# Altium schematic sheet [09] - MICROCONTROLLER UNIT.SchDoc
size A2; DocumentNumber: 9; SheetNumber: 9; SheetTotal: 12; PageSetup: Record=PageOptions|CenterHorizontal=True|CenterVertical=True|PrintScale=0.73|XCorrection=1.00|YCorrection=1.00|PrintKind=0|BorderSize=5000000|LeftOffset=0|BottomOffset=0|Orientation=2|PaperLength=1000|PaperWidth=1000|Scale=100|PaperSource=7|PrintQuality=-3|MediaType=1|DitherType=10|PrintScaleMode=1|PaperKind=A3|PaperIndex=8
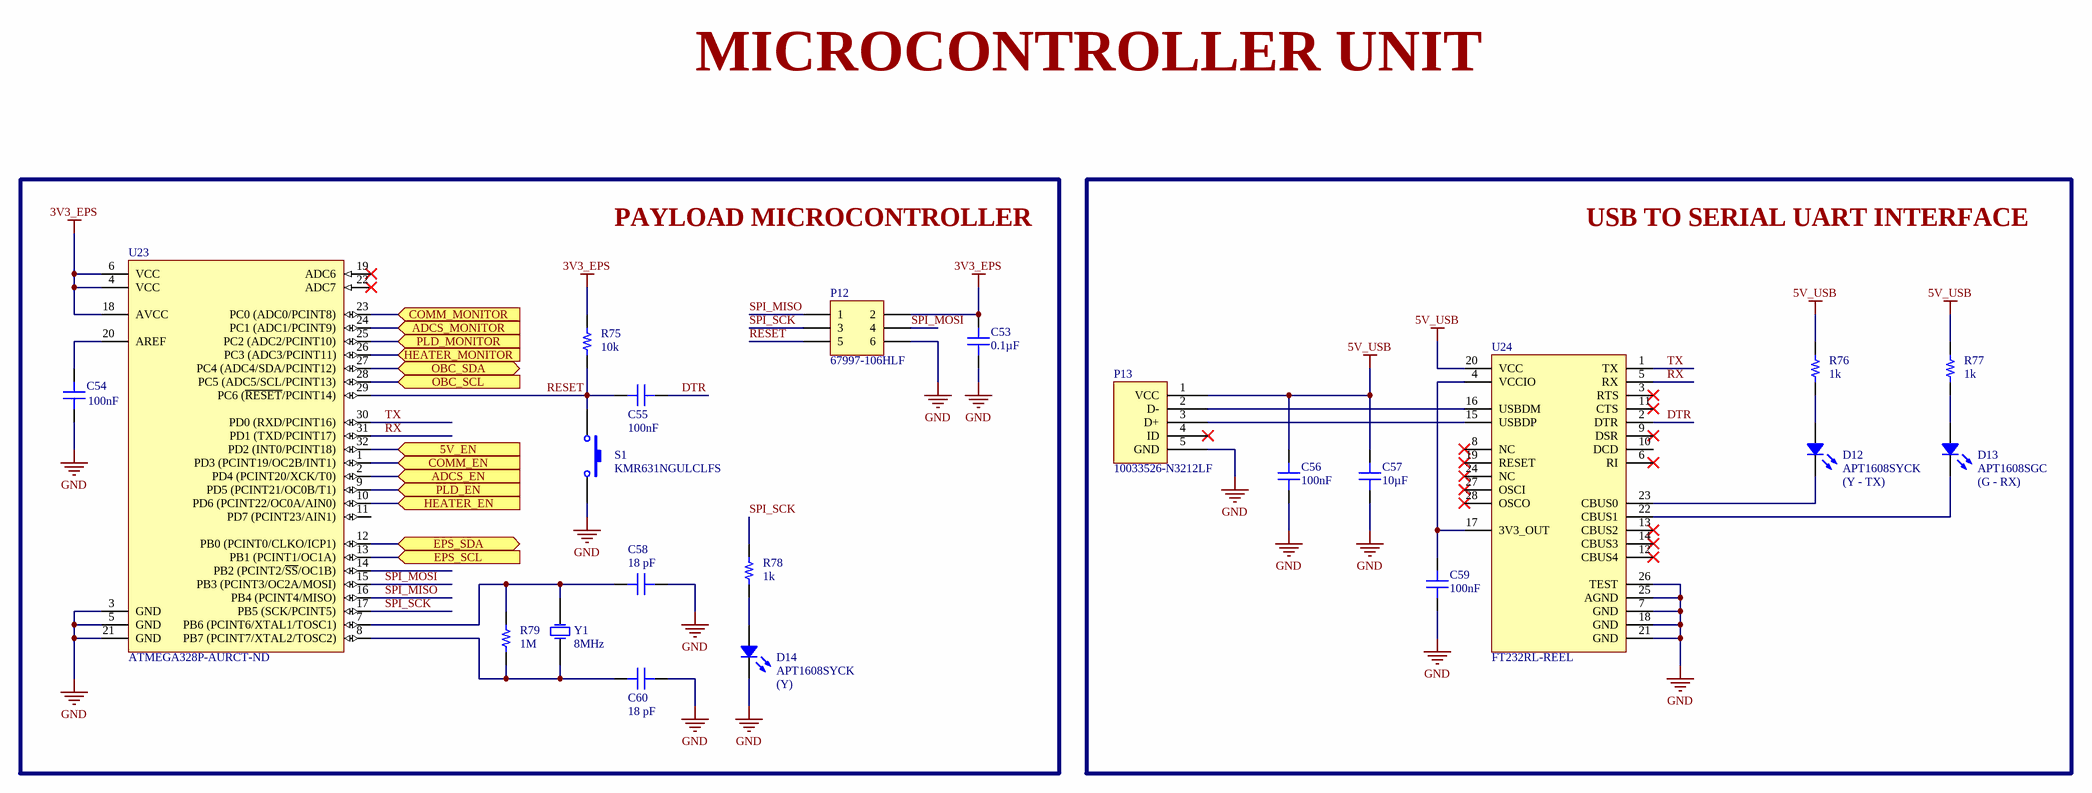
[diagram p0: [09] - MICROCONTROLLER UNIT.SchDoc]

## Parts
C53  Capacitance: 0.1µF  [CAP 0805/2012]  (hidden comment: C2012X7R1H104K085AA)
C54  Capacitance: 100nF  [CAP 0603/1608]  (hidden comment: C0603C104K8RACTU)
C55  Capacitance: 100nF  [CAP 0603/1608]  (hidden comment: C0603C104K8RACTU)
C56  Capacitance: 100nF  [CAP 0603/1608]  (hidden comment: C0603C104K8RACTU)
C57  Capacitance: 10µF  [CAP 0805/2012]  (hidden comment: LMK212BJ106KG-T)
C58  Capacitance: 18 pF  [CAP 0805/2012]  (hidden comment: C0805C180J5GAC-TU)
C59  Capacitance: 100nF  [CAP 0603/1608]  (hidden comment: C0603C104K8RACTU)
C60  Capacitance: 18 pF  [CAP 0805/2012]  (hidden comment: C0805C180J5GAC-TU)
D12  APT1608SYCK  [LED 0603/1608 YELLOW]
D13  APT1608SGC  [LED 0603/1608 GREEN]
D14  APT1608SYCK  [LED 0603/1608 YELLOW]
P12  67997-106HLF  [67997-106HLF]
P13  10033526-N3212LF  [FCI USB 10033526-N3212LF]
R75  Resistance: 10k  [RES 0603/1608]  (hidden comment: RNCP0603FTD10K0)
R76  Resistance: 1k  [RES 0603/1608]  (hidden comment: ESR03EZPJ102)
R77  Resistance: 1k  [RES 0603/1608]  (hidden comment: ESR03EZPJ102)
R78  Resistance: 1k  [RES 0603/1608]  (hidden comment: ESR03EZPJ102)
R79  Resistance: 1M  [RES 0805/2012]  (hidden comment: RT0805FRE071ML)
S1  KMR631NGULCLFS  [KMR631NGLFS]
U23  ATMEGA328P-AURCT-ND  [32A_L]
U24  FT232RL-REEL  [SOP65P790X200-28N]
Y1  Frequency: 8MHz  [ABM7]  (hidden comment: 535-9831-1-ND)

## Blocks framed on the sheet
PAYLOAD MICROCONTROLLER: C53-C55 C58 C60 D14 P12 R75 R78 R79 S1 U23 Y1
USB TO SERIAL UART INTERFACE: C56 C57 C59 D12 D13 P13 R76 R77 U24

## Ports
5V_EN (in), ADCS_EN (in), ADCS_MONITOR (in), COMM_EN (in), COMM_MONITOR (in), EPS_SCL (in), EPS_SDA (bidir), HEATER_EN (in), HEATER_MONITOR (in), OBC_SCL (in), OBC_SDA (bidir), PLD_EN (in), PLD_MONITOR (in)

## Nets
3V3_EPS: C53.2 P12.2 R75.2 U23.4(VCC) U23.6(VCC) U23.18(AVCC)
5V_USB: C56.1 C57.2 P13.1(VCC) R76.2 R77.2 U24.20(VCC)
GND: C53.1 C54.1 C56.2 C57.1 C58.2 C59.2 C60.2 D14.2 P12.6 P13.5(GND) S1.2 U23.3(GND) U23.5(GND) U23.21(GND) U24.7(GND) U24.18(GND) U24.21(GND) U24.25(AGND) U24.26(TEST)
5V_EN: U23.32(PD2_(INT0/PCINT18)) ; port 5V_EN
ADCS_EN: U23.2(PD4_(PCINT20/XCK/T0)) ; port ADCS_EN
ADCS_MONITOR: U23.24(PC1_(ADC1/PCINT9)) ; port ADCS_MONITOR
COMM_EN: U23.1(PD3_(PCINT19/OC2B/INT1)) ; port COMM_EN
COMM_MONITOR: U23.23(PC0_(ADC0/PCINT8)) ; port COMM_MONITOR
DTR: C55.1 U24.2(DTR)
EPS_SCL: U23.13(PB1_(PCINT1/OC1A)) ; port EPS_SCL
EPS_SDA: U23.12(PB0_(PCINT0/CLKO/ICP1)) ; port EPS_SDA
HEATER_EN: U23.10(PD6_(PCINT22/OC0A/AIN0)) ; port HEATER_EN
HEATER_MONITOR: U23.26(PC3_(ADC3/PCINT11)) ; port HEATER_MONITOR
OBC_SCL: U23.28(PC5_(ADC5/SCL/PCINT13)) ; port OBC_SCL
OBC_SDA: U23.27(PC4_(ADC4/SDA/PCINT12)) ; port OBC_SDA
PLD_EN: U23.9(PD5_(PCINT21/OC0B/T1)) ; port PLD_EN
PLD_MONITOR: U23.25(PC2_(ADC2/PCINT10)) ; port PLD_MONITOR
RESET: C55.2 P12.5 R75.1 S1.1 U23.29(PC6_(~{RESET}/PCINT14))
RX: U23.31(PD1_(TXD/PCINT17)) U24.5(RX)
SPI_MISO: P12.1 U23.16(PB4_(PCINT4/MISO))
SPI_MOSI: P12.4 U23.15(PB3_(PCINT3/OC2A/MOSI))
SPI_SCK: P12.3 R78.2 U23.17(PB5_(SCK/PCINT5))
TX: U23.30(PD0_(RXD/PCINT16)) U24.1(TX)
NetC54_2: C54.2 U23.20(AREF)
NetC58_1: C58.1 R79.1 U23.7(PB6_(PCINT6/XTAL1/TOSC1)) Y1.2(OSC2)
NetC59_1: C59.1 U24.4(VCCIO) U24.17(3V3_OUT)
NetC60_1: C60.1 R79.2 U23.8(PB7_(PCINT7/XTAL2/TOSC2)) Y1.1(OSC1)
NetD12_1: D12.1 R76.1
NetD12_2: D12.2 U24.23(CBUS0)
NetD13_1: D13.1 R77.1
NetD13_2: D13.2 U24.22(CBUS1)
NetD14_1: D14.1 R78.1
NetP13_2: P13.2(D-) U24.16(USBDM)
NetP13_3: P13.3(D+) U24.15(USBDP)

Not connected (* = marked no-connect by the designer): P13 4(ID)*; U23 11(PD7_(PCINT23/AIN1)) 14(PB2_(PCINT2/~{SS}/OC1B)) 19(ADC6)* 22(ADC7)*; U24 3(RTS)* 6(RI)* 8(NC)* 9(DSR)* 10(DCD) 11(CTS)* 12(CBUS4)* 13(CBUS2)* 14(CBUS3)* 19(RESET)* 24(NC)* 27(OSCI)* 28(OSCO)*

## Notes on the sheet
- MICROCONTROLLER UNIT
- (near D12) (Y - TX)
- (near D13) (G - RX)
- (near D14) (Y)
- Project:
- Page Contents:
- Size:
- Revision:
- A2
- Document Number:
- Design:
- Date:
- Sheet
- of

## Library data of the parts
C53 = C2012X7R1H104K085AA: CAP CER 0.1UF 50V X7R 0805; Manufacturer: TDK; PCN Part Number: MLCC Part Number Change 30/Nov/2012; Product Training Modules: C Series General Applications SEAT, CCV, and TVCL Design Tools Guide to Replacing an Electrolytic Capacitor with an MLCC; Tolerance: ±10%; Online Catalog: C Series, General Purpose; Kits: 445-9015-KIT-ND  - KIT MLCC 1000PF-47UF 0805 10-50V; Other Names: 445-7534-1; Supplier 1: Digi-Key; Manufacturer Part Number: C2012X7R1H104K085AA; Stock 1: 6397; Pricing 1: 1=0.12, 10=0.086, 100=0.0403, 500=0.0282, 1000=0.0234 (USD); RoHS Information: RoHS Certificate-MLCC; Standard Package: 1; Category: Capacitors; Family: Ceramic Capacitors; Series: C; Packaging: Cut Tape (CT); Voltage - Rated: 50V; Temperature Coefficient: X7R; Mounting Type: Surface Mount, MLCC; Operating Temperature: -55°C ~ 125°C; Applications: General Purpose; Ratings: -; Package / Case: 0805 (2012 Metric); Size / Dimension: 0.079" L x 0.049" W (2.00mm x 1.25mm); Height - Seated (Max): -; Thickness (Max): 0.037" (0.95mm); Lead Spacing: -; Features: -; Lead Style: -; ComponentLink1URL: https://datasheet.ciiva.com/11788/0900766b80c1bb00-11788128.pdf; ComponentLink1Description: https://datasheet.ciiva.com/11788/0900766b80c1bb00-11788128.pdf; ComponentLink2URL: https://datasheet.ciiva.com/6250/tdkmlcccaprange-6250821.pdf; ComponentLink2Description: https://datasheet.ciiva.com/6250/tdkmlcccaprange-6250821.pdf; ComponentLink3URL: https://datasheet.ciiva.com/24217/c2012x7r1h104k085aa-264864-24217862.pdf; ComponentLink3Description: https://datasheet.ciiva.com/24217/c2012x7r1h104k085aa-264864-24217862.pdf; ComponentLink4URL: https://datasheet.ciiva.com/24191/e412-c-24191447.pdf; ComponentLink4Description: https://datasheet.ciiva.com/24191/e412-c-24191447.pdf; ComponentLink5URL: https://datasheet.ciiva.com/6250/tdkmlcccaprange-6250824.pdf; ComponentLink5Description: https://datasheet.ciiva.com/6250/tdkmlcccaprange-6250824.pdf; ComponentLink6URL: https://datasheet.ciiva.com/23803/1796654-23803035.pdf; ComponentLink6Description: https://datasheet.ciiva.com/23803/1796654-23803035.pdf; ComponentLink7URL: https://datasheet.ciiva.com/28602/1571323-28602204.pdf; ComponentLink7Description: https://datasheet.ciiva.com/28602/1571323-28602204.pdf; Supplier Part Number 1: 445-7534-1-ND
C54-C56 C59 = C0603C104K8RACTU: CAP CER 0.1UF 10V X7R 0603; Manufacturer: KEMET; Dielectric Material: Ceramic; Tolerance: 10%; Dissipation Factor: 5%; Supplier 1: Digi-Key; Manufacturer Part Number: C0603C104K8RACTU; Stock 1: 778651; Pricing 1: 1=0.15, 10=0.107, 100=0.0504, 500=0.03536, 1000=0.02927 (USD); Mount: Surface Mount,PCB; Case/Package: 0603; Number of Pins: 2; Case Code (Imperial): 0603; Case Code (Metric): 1608; Contact Plating: Tin,Matte; Min Operating Temperature: -55°C; Max Operating Temperature: 125°C; Voltage Rating: 10V; Packaging: Tape and Reel; Package Quantity: 1; Voltage Rating (DC): 10V; Dielectric: X7R; Termination: SMD/SMT; Voltage: 10V; Length: 1.6mm; Height: 0.8mm; Width: 0.8mm; Lead Pitch: 0.7mm; Thickness: 0.034inch; Depth: 0.8mm; Radiation Hardening: No; REACH SVHC: No SVHC; ComponentLink1URL: http://www.farnell.com/datasheets/2315110.pdf?src-supplier=Farnell; ComponentLink1Description: http://www.farnell.com/datasheets/2315110.pdf?src-supplier=Farnell; ComponentLink2URL: http://www.kemet.com/kemet/web/homepage/kechome.nsf/vapubfiles/KEM_C1002_X7R_SMD.pdf/$file/KEM_C1002_X7R_SMD.pdf?src-supplier=Element14; ComponentLink2Description: http://www.kemet.com/kemet/web/homepage/kechome.nsf/vapubfiles/KEM_C1002_X7R_SMD.pdf/$file/KEM_C1002_X7R_SMD.pdf?src-supplier=Element14; ComponentLink3URL: https://www.verical.com/server-webapp/html/getDatasheet?partID=91529&src-supplier=Verical; ComponentLink3Description: https://www.verical.com/server-webapp/html/getDatasheet?partID=91529&src-supplier=Verical; ComponentLink4URL: http://www.mouser.com/ds/2/212/KEM_C1002_X7R_SMD-1102033.pdf?src-supplier=Mouser; ComponentLink4Description: http://www.mouser.com/ds/2/212/KEM_C1002_X7R_SMD-1102033.pdf?src-supplier=Mouser; ComponentLink5URL: http://www.alliedelec.com/m/d/9bfe7773041ffe9d406e68bc7b377fdd.pdf?src-supplier=Allied+Electronics; ComponentLink5Description: http://www.alliedelec.com/m/d/9bfe7773041ffe9d406e68bc7b377fdd.pdf?src-supplier=Allied+Electronics; ComponentLink6URL: http://www.farnell.com/datasheets/1851736.pdf?src-supplier=Element14; ComponentLink6Description: http://www.farnell.com/datasheets/1851736.pdf?src-supplier=Element14; Supplier Part Number 1: 399-1095-1-ND
C57 = LMK212BJ106KG-T: CAP CER 10UF 10V X5R 0805; Manufacturer: Taiyo Yuden; PCN Part Number: X5R, X7R Dielectrics 23/Jan/2008; Catalog Drawings: xMK Series_0805_1.25; Featured Product: Multilayer Chip Capacitors; Tolerance: ±10%; Online Catalog: M Series; Kits: 587-1797-KIT-ND  - KIT CAP CER HI CAP 0603 & 0805 S; Other Names: 587-1300-1; Supplier 1: Digi-Key; Manufacturer Part Number: LMK212BJ106KG-T; Stock 1: 858762; Pricing 1: 1=0.14, 10=0.1, 100=0.0468, 500=0.0328, 1000=0.0272 (USD); Standard Package: 1; Category: Capacitors; Family: Ceramic Capacitors; Series: M; Packaging: Cut Tape (CT); Voltage - Rated: 10V; Temperature Coefficient: X5R; Mounting Type: Surface Mount, MLCC; Operating Temperature: -55°C ~ 85°C; Applications: General Purpose; Ratings: -; Package / Case: 0805 (2012 Metric); Size / Dimension: 0.079" L x 0.049" W (2.00mm x 1.25mm); Height - Seated (Max): -; Thickness (Max): 0.053" (1.35mm); Lead Spacing: -; Features: -; Lead Style: -; ComponentLink1URL: https://datasheet.ciiva.com/26872/getdatasheetpartid-638410-26872692.pdf; ComponentLink1Description: https://datasheet.ciiva.com/26872/getdatasheetpartid-638410-26872692.pdf; ComponentLink2URL: https://datasheet.ciiva.com/7975/1497285-7975797.pdf; ComponentLink2Description: https://datasheet.ciiva.com/7975/1497285-7975797.pdf; ComponentLink3URL: https://datasheet.ciiva.com/7975/1497285-7975799.pdf; ComponentLink3Description: https://datasheet.ciiva.com/7975/1497285-7975799.pdf; ComponentLink4URL: https://datasheet.ciiva.com/135/mlcc-all-e-135133.pdf; ComponentLink4Description: https://datasheet.ciiva.com/135/mlcc-all-e-135133.pdf; ComponentLink5URL: https://datasheet.ciiva.com/135/mlcc-all-e-135134.pdf; ComponentLink5Description: https://datasheet.ciiva.com/135/mlcc-all-e-135134.pdf; ComponentLink6URL: https://datasheet.ciiva.com/30259/719lmk212abj106kg-t-30259022.pdf; ComponentLink6Description: https://datasheet.ciiva.com/30259/719lmk212abj106kg-t-30259022.pdf; ComponentLink7URL: https://datasheet.ciiva.com/135/mlcc-all-e-135135.pdf; ComponentLink7Description: https://datasheet.ciiva.com/135/mlcc-all-e-135135.pdf; Supplier Part Number 1: 587-1300-1-ND
C58 C60 = C0805C180J5GAC-TU: CAP CER 18PF 50V C0G/NP0 0805; Manufacturer: KEMET; Case Style: Ceramic Chip; Product Depth (mm): 1.25 mm; Product Diameter (mm): Not Required mm; Product Height (mm): 0.78 mm; Product Length (mm): 2 mm; Rad Hardened: No; Temp Coeff (Dielectric): C0G; Tolerance (+ or -): 5%; Voltage: 50VDC; Wire Form: Not Required; Supplier 1: Digi-Key; Manufacturer Part Number: C0805C180J5GAC-TU; Stock 1: 86172; Pricing 1: 1=0.11, 10=0.08, 100=0.0374, 500=0.0262, 1000=0.0217 (USD); Construction: SMT Chip; Failure Rate: Not Required; Mounting Style: Surface Mount; Operating Temp Range: -55C to 125C; Package / Case: 0805; Packaging: Tape and Reel; ComponentLink1URL: https://datasheet.ciiva.com/6136/1725432-6136736.pdf; ComponentLink1Description: https://datasheet.ciiva.com/6136/1725432-6136736.pdf; ComponentLink2URL: https://datasheet.ciiva.com/144/docfinderpartnumber-c0805c180j5gactu-144929.pdf; ComponentLink2Description: https://datasheet.ciiva.com/144/docfinderpartnumber-c0805c180j5gactu-144929.pdf; ComponentLink3URL: https://datasheet.ciiva.com/22746/1769375-22746770.pdf; ComponentLink3Description: https://datasheet.ciiva.com/22746/1769375-22746770.pdf; ComponentLink4URL: https://datasheet.ciiva.com/28696/1789732-28696024.pdf; ComponentLink4Description: https://datasheet.ciiva.com/28696/1789732-28696024.pdf; ComponentLink5URL: https://datasheet.ciiva.com/7842/1725432-7842235.pdf; ComponentLink5Description: https://datasheet.ciiva.com/7842/1725432-7842235.pdf; ComponentLink6URL: https://datasheet.ciiva.com/11463/kem-c1003-c0g-smd-11463499.pdf; ComponentLink6Description: https://datasheet.ciiva.com/11463/kem-c1003-c0g-smd-11463499.pdf; ComponentLink7URL: https://datasheet.ciiva.com/7842/1725432-7842236.pdf; ComponentLink7Description: https://datasheet.ciiva.com/7842/1725432-7842236.pdf; ComponentLink8URL: https://datasheet.ciiva.com/26923/getdatasheetpartid-759702-26923980.pdf; ComponentLink8Description: https://datasheet.ciiva.com/26923/getdatasheetpartid-759702-26923980.pdf; ComponentLink9URL: https://datasheet.ciiva.com/5419/kem-c1003-c0g-smd-356956-5419246.pdf; ComponentLink9Description: https://datasheet.ciiva.com/5419/kem-c1003-c0g-smd-356956-5419246.pdf; Supplier Part Number 1: 399-1112-1-ND
D12 D14 = APT1608SYCK: LED YELLOW CLEAR CHIP SMD; Manufacturer: Kingbright; Catalog Drawings: APT1608 Series Top / APT1608 Series Side; 3D Model: APT1608x.sldprt / APT1608x.pro / APT1608x.igs / APT1608x.stp; Wavelength - Dominant: 590nm; Millicandela Rating: 150mcd; Voltage - Forward (Vf) (Typ): 2V; Current - Test: 20mA; Viewing Angle: 120°; Lens Style/Size: Rectangle with Flat Top, 1.2mm x 0.8mm; Online Catalog: 0603 Rectangle with Flat Top Chip LEDs; Other Names: 754-1124-2; Supplier 1: Digi-Key; Manufacturer Part Number: APT1608SYCK; Stock 1: 241560; Pricing 1: 1=0.43, 10=0.307, 25=0.2352, 100=0.1535, 250=0.1125, 500=0.0955, 1000=0.0784 (USD); Standard Package: 2,000; Category: Optoelectronics; Family: LED Indication - Discrete; Packaging: Tape & Reel (TR); Color: Yellow; Wavelength - Peak: 590nm; Lens Type: Clear; Package / Case: 0603 (1608 Metric); Size / Dimension: 1.60mm L x 0.80mm W; Height: 0.75mm; Mounting Type: Surface Mount; ComponentLink1URL: https://datasheet.ciiva.com/2113/apt1608syck-2113824.pdf; ComponentLink1Description: https://datasheet.ciiva.com/2113/apt1608syck-2113824.pdf; ComponentLink2URL: https://datasheet.ciiva.com/2113/apt1608syck-2113825.pdf; ComponentLink2Description: https://datasheet.ciiva.com/2113/apt1608syck-2113825.pdf; ComponentLink3URL: https://datasheet.ciiva.com/2113/apt1608syck-2113826.pdf; ComponentLink3Description: https://datasheet.ciiva.com/2113/apt1608syck-2113826.pdf; ComponentLink4URL: https://datasheet.ciiva.com/4688/apt1608syck-35136-4688900.pdf; ComponentLink4Description: https://datasheet.ciiva.com/4688/apt1608syck-35136-4688900.pdf; ComponentLink5URL: https://datasheet.ciiva.com/14603/70062842-14603786.pdf; ComponentLink5Description: https://datasheet.ciiva.com/14603/70062842-14603786.pdf; Supplier Part Number 1: 754-1124-1-ND
D13 = APT1608SGC: LED 1.6X0.8MM 568NM GRN CLR SMD; Manufacturer: Kingbright; Catalog Drawings: APT1608 Series Top / APT1608 Series Side; 3D Model: APT1608x.sldprt / APT1608x.pro / APT1608x.igs / APT1608x.stp; Color: Green; Wavelength - Peak: 565nm; Millicandela Rating: 15mcd; Voltage - Forward (Vf) (Typ): 2.2V; Current - Test: 20mA; Viewing Angle: 120°; Lens Type: Clear; Lens Style/Size: Rectangle with Flat Top, 1.2mm x 0.8mm; Online Catalog: 0603 Rectangle with Flat Top Chip LEDs; Other Names: 754-1121-2; Supplier 1: Digi-Key; Manufacturer Part Number: APT1608SGC; Stock 1: 466268; Pricing 1: 1=0.39, 10=0.282, 25=0.208, 100=0.1485, 250=0.101, 500=0.0891, 1000=0.0698 (USD); Standard Package: 2,000; Category: Optoelectronics; Family: LED Indication - Discrete; Packaging: Tape & Reel (TR); Wavelength - Dominant: 568nm; Package / Case: 0603 (1608 Metric); Size / Dimension: 1.60mm L x 0.80mm W; Height: 0.75mm; Mounting Type: Surface Mount; ComponentLink1URL: https://datasheet.ciiva.com/2113/apt1608sgc-2113808.pdf; ComponentLink1Description: https://datasheet.ciiva.com/2113/apt1608sgc-2113808.pdf; ComponentLink2URL: https://datasheet.ciiva.com/12400/apt1608sgc-32861-12400932.pdf; ComponentLink2Description: https://datasheet.ciiva.com/12400/apt1608sgc-32861-12400932.pdf; ComponentLink3URL: https://datasheet.ciiva.com/14603/70062839-14603927.pdf; ComponentLink3Description: https://datasheet.ciiva.com/14603/70062839-14603927.pdf; Supplier Part Number 1: 754-1121-1-ND; Supplier 2: Digi-Key; Supplier Part Number 2: 311-10.0MCRCT-ND
P12 = 67997-106HLF: CONN HEADER 6POS .100 STR 30AU; Manufacturer: Amphenol FCI; Pitch Spacing: 2.54mm; No. of Rows: 2; No. of Contacts: 6; Contact Termination: Through Hole Vertical; Supplier 1: Digi-Key; Manufacturer Part Number: 67997-106HLF; Stock 1: 896; Pricing 1: 1=1.73, 10=1.568, 100=1.3436, 500=1.1197, 1000=0.9597, 5000=0.8509, 10000=0.8317 (USD); Series: 67997; Gender: Header; Contact Plating: Gold; Contact Material: Phosphor Bronze; ComponentLink1URL: https://datasheet.ciiva.com/10149/67996-10149221.pdf; ComponentLink1Description: https://datasheet.ciiva.com/10149/67996-10149221.pdf; ComponentLink2URL: https://datasheet.ciiva.com/46393/1876884-46393067.pdf; ComponentLink2Description: https://datasheet.ciiva.com/46393/1876884-46393067.pdf; ComponentLink3URL: https://datasheet.ciiva.com/722/67996-722044.pdf; ComponentLink3Description: https://datasheet.ciiva.com/722/67996-722044.pdf; ComponentLink4URL: https://datasheet.ciiva.com/5153/67996-222463-5153820.pdf; ComponentLink4Description: https://datasheet.ciiva.com/5153/67996-222463-5153820.pdf; ComponentLink5URL: https://datasheet.ciiva.com/16726/67996-16726286.pdf; ComponentLink5Description: https://datasheet.ciiva.com/16726/67996-16726286.pdf; Supplier Part Number 1: 609-3393-ND
P13 = 10033526-N3212LF: CONN MINI USB RCPT RA TYPE B SMD; Manufacturer: Amphenol FCI; Brand: FCI; Number of Contacts: 5 Contact; Number of Ports: 1 Port; Gender: Female; Connector Type: Mini USB Type B Receptacle; Insulation Resistance: 100 MOhms; Mounting Angle: Right; Supplier 1: Digi-Key; Manufacturer Part Number: 10033526-N3212LF; Stock 1: 10314; Pricing 1: 1=0.71, 10=0.669, 25=0.602, 50=0.5352, 100=0.5128, 250=0.4682 (USD); Product Category: USB Connectors; RoHS: Details; Product: Mini USB Type B Connectors; Standard: USB; Termination Style: Solder Pad; Color: Black; Contact Material: Copper Alloy; Contact Plating: Gold; Flammability Rating: UL 94 V-0; Packaging: Reel; Shell Plating: Nickel; Factory Pack Quantity: 750; ComponentLink1URL: https://datasheet.ciiva.com/15181/getdatasheetpartid-168038-15181221.pdf; ComponentLink1Description: https://datasheet.ciiva.com/15181/getdatasheetpartid-168038-15181221.pdf; ComponentLink2URL: https://datasheet.ciiva.com/29660/10033526-29660229.pdf; ComponentLink2Description: https://datasheet.ciiva.com/29660/10033526-29660229.pdf; ComponentLink3URL: https://datasheet.ciiva.com/29660/10033526-29660230.pdf; ComponentLink3Description: https://datasheet.ciiva.com/29660/10033526-29660230.pdf; ComponentLink4URL: https://datasheet.ciiva.com/3094/10033526-3094696.pdf; ComponentLink4Description: https://datasheet.ciiva.com/3094/10033526-3094696.pdf; ComponentLink5URL: https://datasheet.ciiva.com/16668/10033526-16668584.pdf; ComponentLink5Description: https://datasheet.ciiva.com/16668/10033526-16668584.pdf; ComponentLink6URL: https://datasheet.ciiva.com/3094/10033526-3094413.pdf; ComponentLink6Description: https://datasheet.ciiva.com/3094/10033526-3094413.pdf; Supplier Part Number 1: 609-4700-1-ND
R75 = RNCP0603FTD10K0: RES SMD 10K OHM 1% 1/8W 0603; Manufacturer: Stackpole Electronics; Max Power Dissipation: 125mW; Temperature Coefficient: 100ppm/°C; Supplier 1: Digi-Key; Manufacturer Part Number: RNCP0603FTD10K0; Stock 1: 579582; Pricing 1: 1 = 0.10000, 10 = 0.06700, 100 = 0.02730, 1000 = 0.01224, 2500 = 0.01063 (USD); RoHS: Yes; Mount: Surface Mount; Case/Package: 0603; Case Code (Metric): 1608; Case Code (Imperial): 0603; Contact Plating: Tin; Min Operating Temperature: -55°C; Max Operating Temperature: 155°C; Packaging: Tape and Reel; Tolerance: 1%; Composition: Thin Film; Number of Terminations: 2; Features: Moisture Resistant; Length: 0.059inch; Height: 0.02inch; Width: 0.031inch; Radiation Hardening: No; Lead Free: Lead Free; ComponentLink1URL: https://www.seielect.com/Catalog/SEI-rncp.pdf?src-supplier=Avnet; ComponentLink1Description: https://www.seielect.com/Catalog/SEI-rncp.pdf?src-supplier=Avnet; ComponentLink2URL: https://www.seielect.com/catalog/SEI-Packaging.pdf?src-supplier=Digi-Key; ComponentLink2Description: https://www.seielect.com/catalog/SEI-Packaging.pdf?src-supplier=Digi-Key; ComponentLink3URL: https://www.seielect.com/Catalog/SEI-rncp.pdf?src-supplier=Digi-Key; ComponentLink3Description: https://www.seielect.com/Catalog/SEI-rncp.pdf?src-supplier=Digi-Key; Supplier Part Number 1: RNCP0603FTD10K0CT-ND
R76-R78 = ESR03EZPJ102: RES SMD 1K OHM 5% 1/4W 0603; Manufacturer: Rohm; Temperature Coefficient: 200ppm/°C; Max Power Dissipation: 250mW; Supplier 1: Digi-Key; Manufacturer Part Number: ESR03EZPJ102; Stock 1: 187581; Pricing 1: 1 = 0.10000, 10 = 0.08300, 100 = 0.03180, 1000 = 0.01398, 2500 = 0.01207 (USD); RoHS: Yes; Case/Package: 0603; Case Code (Metric): 1608; Case Code (Imperial): 0603; Min Operating Temperature: -55°C; Max Operating Temperature: 155°C; Tolerance: 5%; Package Quantity: 1; Packaging: Tape and Reel; Composition: Thick Film; Number of Terminations: 2; Features: Automotive AEC-Q200; Length: 0.063inch; Height: 0.022inch; Width: 0.031inch; Lead Free: Lead Free; ComponentLink1URL: https://datasheet.ciiva.com/2469/esr-2469603.pdf?src-supplier=Digi-Key; ComponentLink1Description: https://datasheet.ciiva.com/2469/esr-2469603.pdf?src-supplier=Digi-Key; ComponentLink2URL: https://datasheet.ciiva.com/2469/esr-2469604.pdf?src-supplier=Digi-Key; ComponentLink2Description: https://datasheet.ciiva.com/2469/esr-2469604.pdf?src-supplier=Digi-Key; ComponentLink3URL: https://datasheet.ciiva.com/2469/esr-2469605.pdf?src-supplier=Digi-Key; ComponentLink3Description: https://datasheet.ciiva.com/2469/esr-2469605.pdf?src-supplier=Digi-Key; Supplier Part Number 1: RHM1.0KDCT-ND
R79 = RT0805FRE071ML: RES SMD 1M OHM 1% 1/8W 0805; Manufacturer: Yageo; Power Rating: 125mW; Voltage Rating: 150V; Temperature Coefficient: 50ppm/°C; Supplier 1: Digi-Key; Manufacturer Part Number: RT0805FRE071ML; Stock 1: 91463; Pricing 1: 1=0.11, 10=0.097, 100=0.0375, 1000=0.01648, 2500=0.01423 (USD); Case/Package: 0805; Number of Pins: 2; Case Code (Metric): 2012; Case Code (Imperial): 0805; Min Operating Temperature: -55°C; Max Operating Temperature: 125°C; Tolerance: 1%; Packaging: Tape and Reel; Package Quantity: 5000; Composition: Thin Film; Number of Terminations: 2; Termination: SMD/SMT; Max Power Dissipation: 125mW; Voltage Rating (DC): 150V; Features: Moisture Resistant; Length: 0.079inch; Height: 0.024inch; Width: 0.049inch; REACH SVHC: No SVHC; Lead Free: Lead Free; Supplier Part Number 1: YAG3361DKR-ND
S1 = KMR631NGULCLFS: SWITCH TACTILE SPST-NO 50MA 32V; Manufacturer: ITT C&K; Mechanical Life: 150000Cycles; Illumination Type: Non-Illuminated; Operating Force: 300gf; Throw Configuration: SPST; Switch Function: Off-Mom; Actuator Type: Standard; Ratings: Dust Tight,IP67,Waterproof; Supplier 1: Digi-Key; Manufacturer Part Number: KMR631NGULCLFS; Stock 1: 0; Mount: Surface Mount; Min Operating Temperature: -40°C; Max Operating Temperature: 85°C; Packaging: Tape and Reel; Termination: Gull Wing; Supplier Part Number 1: CKN10685DKR-ND
U23 = ATMEGA328P-AUR: IC MCU 8BIT 32KB FLASH 32TQFP; Manufacturer: Microchip / Atmel; Product Training Modules: MCU Product Line Introduction / megaAVR Introduction; Core Processor: AVR; Core Size: 8-Bit; Speed: 20MHz; Connectivity: I²C, SPI, UART/USART; Peripherals: Brown-out Detect/Reset, POR, PWM, WDT; Number of I /O: 23; Program Memory Size: 32KB (16K x 16); EEPROM Size: 1K x 8; RAM Size: 2K x 8; Voltage - Supply (Vcc/Vdd): 1.8 V ~ 5.5 V; Data Converters: A/D 8x10b; Oscillator Type: Internal; Dynamic Catalog: AVR® ATmega; For Use With: ATSTK600-RC29-ND / - STK600 ROUTING CARD AVR; Other Names: ATMEGA328P-AUR-ND; Supplier 1: Digi-Key; Manufacturer Part Number: ATMEGA328P-AUR; Stock 1: 41082; Pricing 1: 1=2.2, 25=2.0248, 100=1.8338 (USD); Standard Package: 2,000; Category: Integrated Circuits (ICs); Family: Embedded - Microcontrollers; Series: AVR® ATmega; Program Memory Type: FLASH; Operating Temperature: -40°C ~ 85°C; Package / Case: 32-TQFP; Packaging: Tape & Reel (TR); ComponentLink1URL: http://www.atmel.com/images/atmel-8271-8-bit-avr-microcontroller-atmega48a-48pa-88a-88pa-168a-168pa-328-328p_datasheet_summary.pdf; ComponentLink1Description: http://www.atmel.com/images/atmel-8271-8-bit-avr-microcontroller-atmega48a-48pa-88a-88pa-168a-168pa-328-328p_datasheet_summary.pdf; Supplier Part Number 1: ATMEGA328P-AURCT-ND
U24 = FT232RL-REEL: IC USB FS SERIAL UART 28-SSOP; Manufacturer: FTDI; Interface: RS-232,RS-422,RS-485,UART; Number of Channels: 1; Max Supply Voltage: 5.25V; Min Supply Voltage: 3.3V; Data Rate: 12Mbps; Operating Supply Current: 15mA; Voltage: 5V; Supplier 1: Digi-Key; Manufacturer Part Number: FT232RL-REEL; Stock 1: 281044; Pricing 1: 1=4.5, 10=4.05, 100=3.65, 250=3.25, 500=2.85002, 1000=2.65 (USD); Mount: Surface Mount; Case/Package: SSOP; Number of Pins: 28; Weight: 0.080001oz; Min Operating Temperature: -40°C; Max Operating Temperature: 85°C; Packaging: Tape and Reel; Package Quantity: 2000; Number of Transceivers: 1; Length: 10.2mm; Height: 1.75mm; Width: 5.3mm; Radiation Hardening: No; REACH SVHC: No SVHC; Lead Free: Lead Free; ComponentLink1URL: https://datasheet.ciiva.com/34304/2161019-34304054.pdf; ComponentLink1Description: https://datasheet.ciiva.com/34304/2161019-34304054.pdf; ComponentLink2URL: https://datasheet.ciiva.com/1787/ds-ft232r-1787047.pdf; ComponentLink2Description: https://datasheet.ciiva.com/1787/ds-ft232r-1787047.pdf; ComponentLink3URL: https://datasheet.ciiva.com/1787/ds-ft232r-1787048.pdf; ComponentLink3Description: https://datasheet.ciiva.com/1787/ds-ft232r-1787048.pdf; ComponentLink4URL: https://datasheet.ciiva.com/1787/ds-ft232r-1787049.pdf; ComponentLink4Description: https://datasheet.ciiva.com/1787/ds-ft232r-1787049.pdf; ComponentLink5URL: https://datasheet.ciiva.com/4787/ds-ft232r-11534-4787658.pdf; ComponentLink5Description: https://datasheet.ciiva.com/4787/ds-ft232r-11534-4787658.pdf; ComponentLink6URL: https://datasheet.ciiva.com/15150/getdatasheetpartid-643207-15150506.pdf; ComponentLink6Description: https://datasheet.ciiva.com/15150/getdatasheetpartid-643207-15150506.pdf; ComponentLink7URL: https://datasheet.ciiva.com/16200/ds-ft232r-16200652.pdf; ComponentLink7Description: https://datasheet.ciiva.com/16200/ds-ft232r-16200652.pdf; ComponentLink8URL: https://datasheet.ciiva.com/26841/ft232rl-reel-26841080.pdf; ComponentLink8Description: https://datasheet.ciiva.com/26841/ft232rl-reel-26841080.pdf; Supplier Part Number 1: 768-1007-6-ND
Y1 = 535-9831-1-ND: CRYSTAL 8.0000MHZ 18PF SMD; Manufacturer: Abracon; Manufacturer Part Number: ABM7-8.000MHZ-D2Y-T; Frequency Tolerance: 20ppm; ESR (Equivalent Series Resistance): 100R; Frequency Stability: 30ppm; Series Resistance: 80R; Supplier 1: Digi-Key; Stock 1: 151370; Pricing 1: 1=0.72, 10=0.633, 50=0.5912, 100=0.5225, 500=0.495 (USD); Mount: Surface Mount; Case/Package: CSMD; Number of Pins: 2; Min Operating Temperature: -40°C; Max Operating Temperature: 85°C; Load Capacitance: 18pF; Package Quantity: 1000; Packaging: Tape and Reel; Tolerance: 20ppm; Termination: SMD/SMT; Composition: Ceramic; Length: 6mm; Height: 0.055inch; Width: 0.138inch; Depth: 3.5mm; Radiation Hardening: No; REACH SVHC: Yes; Lead Free: Lead Free; Supplier Part Number 1: 535-9831-6-ND